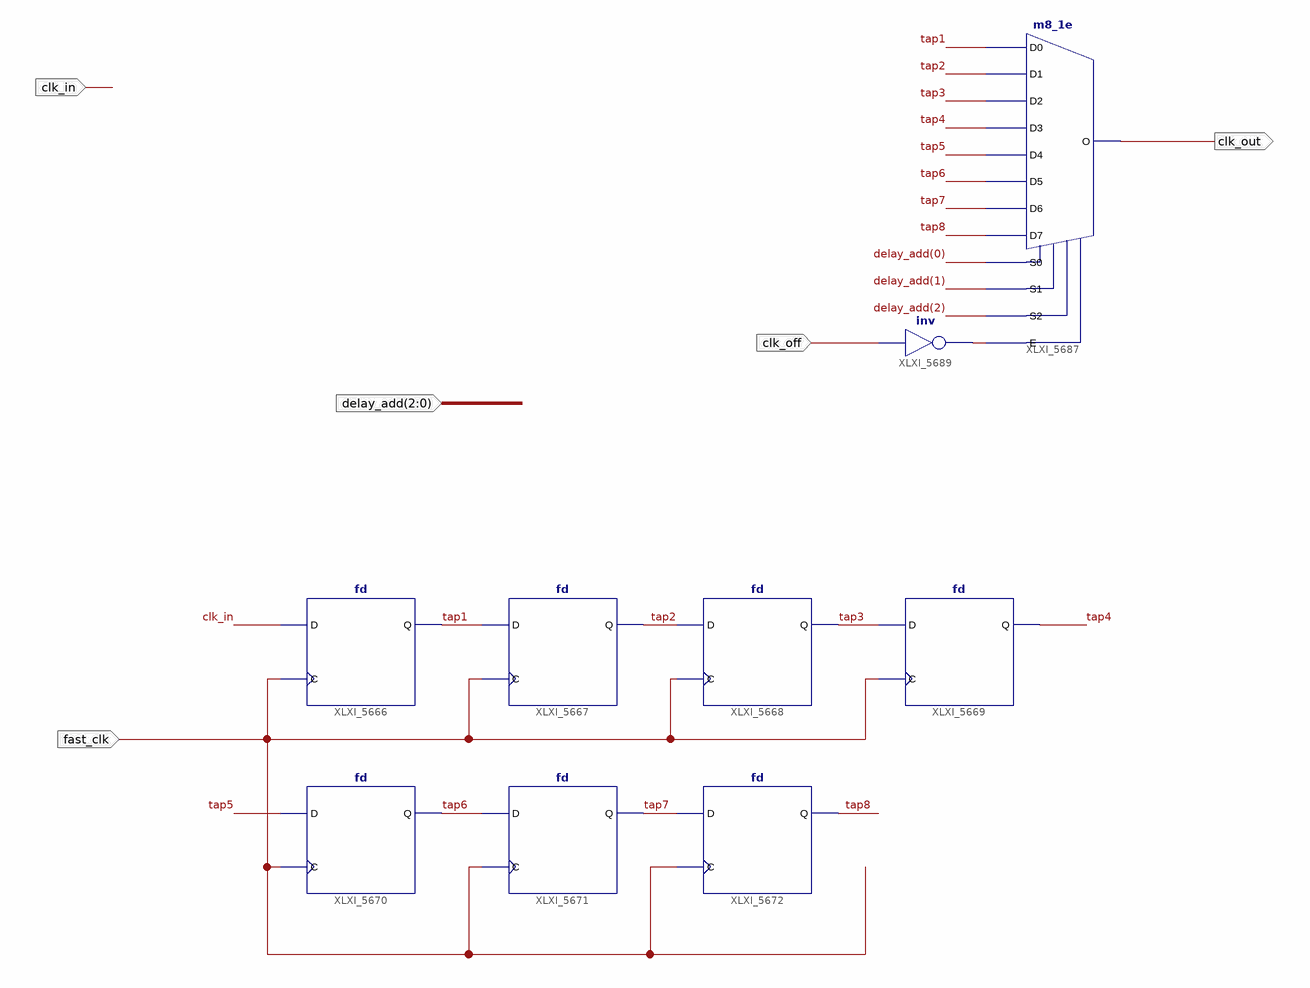
[diagram p0: schematic sheet 1]
// Xilinx ISE schematic vdelay_8tap.sch (virtex4) as structural Verilog: 9 symbols, 5 ports
module vdelay_8tap (
  input  clk_in,
  input  fast_clk,
  input  [2:0] delay_add,
  input  clk_off,
  output clk_out
);

  wire tap1, tap2, tap3, tap4, tap5, tap6, tap7, tap8, XLXN_17508;

  fd XLXI_5666 (.C(fast_clk), .D(clk_in), .Q(tap1));
  fd XLXI_5667 (.C(fast_clk), .D(tap1), .Q(tap2));
  fd XLXI_5668 (.C(fast_clk), .D(tap2), .Q(tap3));
  fd XLXI_5669 (.C(fast_clk), .D(tap3), .Q(tap4));
  fd XLXI_5670 (.C(fast_clk), .D(tap5), .Q(tap6));
  fd XLXI_5671 (.C(fast_clk), .D(tap6), .Q(tap7));
  fd XLXI_5672 (.C(fast_clk), .D(tap7), .Q(tap8));
  m8_1e XLXI_5687 (
    .D0(tap1), .D1(tap2), .D2(tap3), .D3(tap4), .D4(tap5), .D5(tap6), .D6(tap7), .D7(tap8), .E(XLXN_17508),
    .S0(delay_add[0]), .S1(delay_add[1]), .S2(delay_add[2]), .O(clk_out));
  not XLXI_5689 (XLXN_17508, clk_off);
endmodule
